# EAGLE schematic ScanseSweepv1.1 (EAGLE 9.4.2)
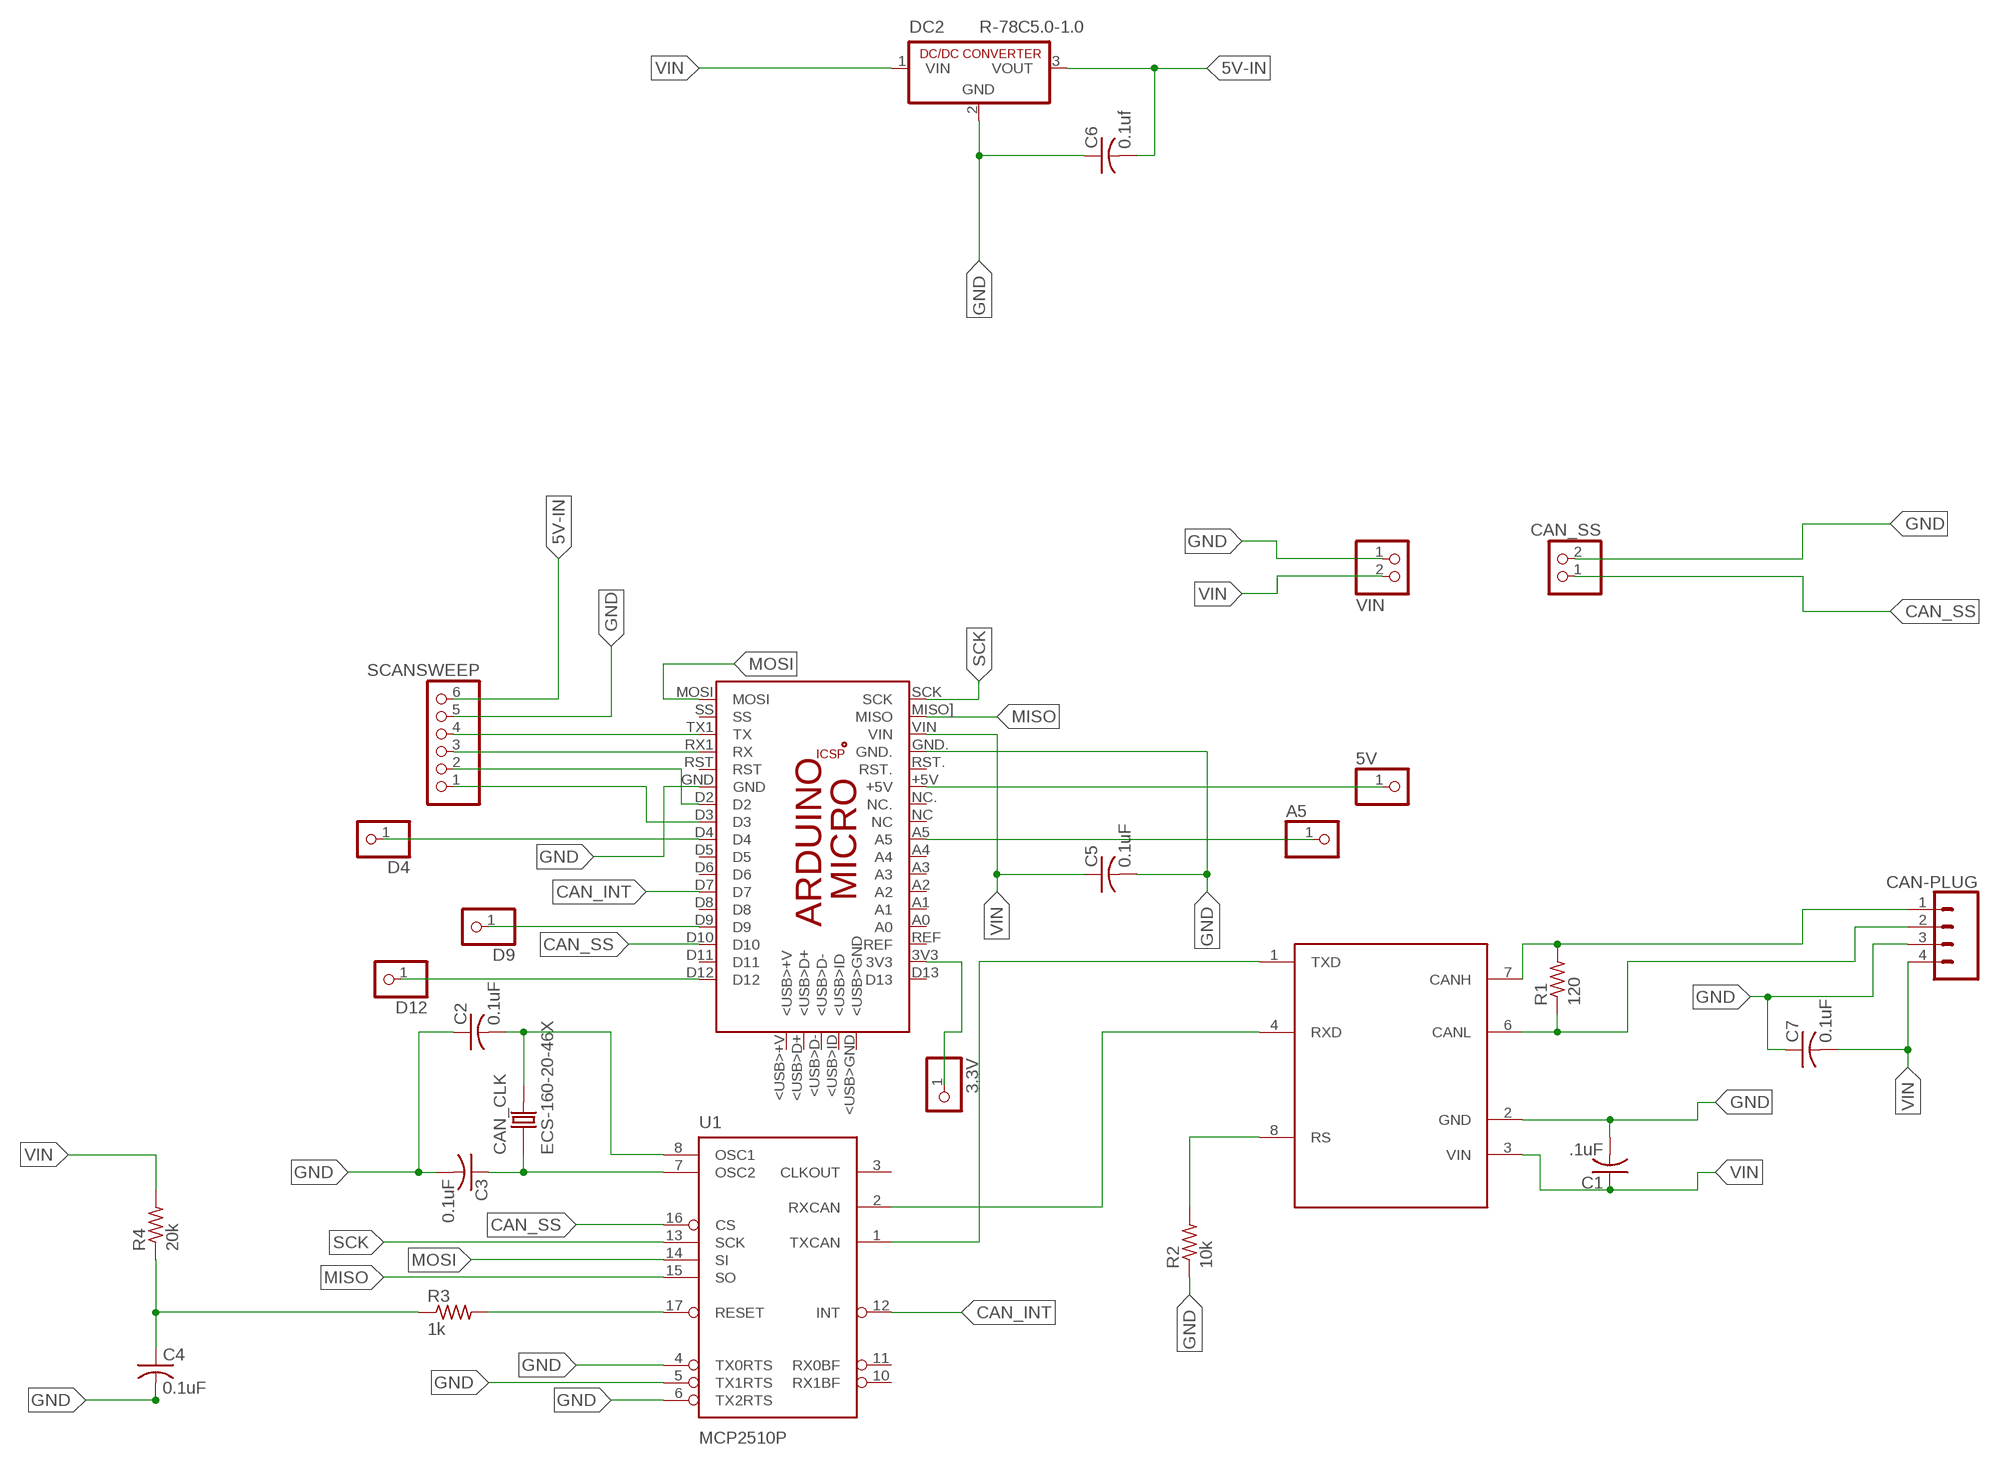
[diagram p0: schematic, sheet 1]

## Parts
3.3V  PINHD-1X1  [1X01]
5V  PINHD-1X1  [1X01]
A5  PINHD-1X1  [1X01]
C1  .1uF  C-US025-024X044  [C025-024X044]
C2  0.1uF  C-US025-024X044  [C025-024X044]
C3  0.1uF  C-US025-024X044  [C025-024X044]
C4  0.1uF  C-US025-024X044  [C025-024X044]
C5  0.1uF  C-US025-024X044  [C025-024X044]
C6  0.1uf  C-US025-024X044  [C025-024X044]
C7  0.1uF  C-US025-024X044  [C025-024X044]
CAN_CLK  ECS-160-20-46X  [XTAL_ECS-160-20-46X]
CAN_SS_TEST  CAN_SS  PINHD-1X2  [1X02]
D4  PINHD-1X1  [1X01]
D9  PINHD-1X1  [1X01]
D12  PINHD-1X1  [1X01]
DC2  R-78C5.0-1.0  [SIP3]
J1  CAN-PLUG  CONN_04SCREW  [SCREWTERMINAL-3.5MM-4]
PCB1  ARDUINO_MICRO  [ARDUINO_MICRO]
R1  120  R-US_0204/5  [0204/5]
R2  10k  R-US_0204/5  [0204/5]
R3  1k  R-US_0204/5  [0204/5]
R4  20k  R-US_0204/5  [0204/5]
SCANSESWEEP  SCANSWEEP  PINHD-1X6  [1X06]
U1  MCP2510P  [DIL18]
U$1  MCP2551MCP2551  [DIL08]
VIN_TEST  VIN  PINHD-1X2  [1X02]

## Nets
3.3V: 3.3V.1 PCB1.3V3
5V: 5V.1 PCB1.+5V
5V-IN: C6.2 DC2.3(VOUT) SCANSESWEEP.6
A5: A5.1 PCB1.A5
CAN_INT: PCB1.D7 U1.12(INT)
CAN_SS: CAN_SS_TEST.1 PCB1.D10 U1.16(CS)
CANH: J1.1 R1.2 U$1.7(CANH)
CANL: J1.2 R1.1 U$1.6(CANL)
D2: PCB1.D2 SCANSESWEEP.2
D3: PCB1.D3 SCANSESWEEP.1
D4: D4.1 PCB1.D4
D9: D9.1 PCB1.D9
D12: D12.1 PCB1.D12
GND: C1.2 C2.1 C3.2 C4.2 C5.2 C6.1 C7.1 CAN_SS_TEST.2 DC2.2(GND) J1.3 PCB1.GND PCB1.GND. R2.1 SCANSESWEEP.5 U1.4(TX0RTS) U1.5(TX1RTS) U1.6(TX2RTS) U$1.2(GND) VIN_TEST.1
MISO: PCB1.MISO](MISO) U1.15(SO)
MOSI: PCB1.MOSI U1.14(SI)
N$13: C4.1 R3.1 R4.1
OSC1: C2.2 CAN_CLK.2 U1.8(OSC1)
OSC2: C3.1 CAN_CLK.1 U1.7(OSC2)
RESET: R3.2 U1.17(RESET)
RS: R2.2 U$1.8(RS)
RX: PCB1.RX1(RX) SCANSESWEEP.3
RXCAN: U1.2(RXCAN) U$1.4(RXD)
SCK: PCB1.SCK U1.13(SCK)
TX: PCB1.TX1(TX) SCANSESWEEP.4
TXCAN: U1.1(TXCAN) U$1.1(TXD)
VIN: C1.1 C5.1 C7.2 DC2.1(VIN) J1.4 PCB1.VIN R4.2 U$1.3(VIN) VIN_TEST.2
Unconnected: PCB1.5V PCB1.<USB>+V PCB1.<USB>D+ PCB1.<USB>D- PCB1.<USB>GND PCB1.<USB>ID PCB1.A0 PCB1.A1 PCB1.A2 PCB1.A3 PCB1.A4 PCB1.D5 PCB1.D6 PCB1.D8 PCB1.D11 PCB1.D13 PCB1.GND_ PCB1.MISO. PCB1.MOSI. PCB1.NC PCB1.NC. PCB1.REF PCB1.RESET.. PCB1.RST PCB1.RST. PCB1.SCK. PCB1.SS U1.3(CLKOUT) U1.9(VSS) U1.10(RX1BF) U1.11(RX0BF) U1.18(VDD)

## Library data of the parts
3.3V 5V A5 D4 D9 D12 = pinhead:PINHD-1X1: PIN HEADER
C1-C7 = rcl:C-US: CAPACITOR, American symbol; SPICEPREFIX: C
CAN_CLK = ECS-160-20-46X:ECS-160-20-46X: QUARTZ CRYSTAL T/H; DESCRIPTION: Crystal 16MHz ±30ppm _Tol_ ±50ppm _Stability_ 20pF FUND 50Ohm; DIGI-KEY_PART_NUMBER: XC1759-ND; DIGI-KEY_PURCHASE_URL: https://www.digikey.com/product-detail/en/ecs-inc/ECS-160-20-46X/XC1759-ND/2676589?utm_source=snapeda&utm_medium=aggregator&utm_campaign=symbol; MF: ECS Inc.; MP: ECS-160-20-46X; PACKAGE: HC46/X ECS International
CAN_SS_TEST VIN_TEST = pinhead:PINHD-1X2: PIN HEADER
DC2 = dc-dc-converter:R-78C*-1.0: INNOLINE DC/DC-Converter 1.0 AMP SIP3 Single Output Source: Data sheet <http://www.mikrocontroller.net/attachment/150645/157764-da-01-en-DC_DC_WANDLER_R_78C5_0_1_0.pdf>
J1 = SparkFun-Connectors:CONN_04: Multi connection point. Often used as Generic Header-pin footprint for 0.1 inch spaced/style header connections On any of the 0.1 inch spaced packages, you can populate with these: Break Away Headers - Straight <https://www.sparkfun.com/products/116> (PRT-00116) Break Away Male Headers - Right Angle <https://www.sparkfun.com/products/553> (PRT-00553) Female Headers <https://www.sparkfun.com/products/115> (PRT-00115) Break Away Headers - Machine Pin <https://www.sparkfun.com/products/117> (PRT-00117) Break Away Female Headers - Swiss Machine Pin <https://www.sparkfun.com/products/743> (PRT-00743) For SCREWTERMINALS and SPRING TERMINALS visit here: Screw Terimnals on SparkFun.com <https://www.sparkfun.com/search/results?term=Screw+Terminals> (5mm/3.5mm/2.54mm spacing) This device is also useful as a general connection point to wire up your design to another part of your project. Our various solder wires solder well into these plated through hole pads. Hook-Up Wire - Assortment (Stranded, 22 AWG) <https://www.sparkfun.com/products/11375> (PRT-11375) Hook-Up Wire - Assortment (Solid Core, 22 AWG) <https://www.sparkfun.com/products/11367> (PRT-11367) View the entire wire category on our website here <https://www.sparkfun.com/categories/141> Special notes: Molex polarized connector foot print use with SKU : PRT-08231 with associated crimp pins and housings. 1MM SMD Version SKU: PRT-10208; PROD_ID: CONN-14485
PCB1 = E14_Arduino_revC:ARDUINO_MICRO: Device for representing an Arduino Micro board with a footprint in an EAGLE design. Created by Dave Young for Element14. More EAGLE documentation at: http://www.element14.com/community/community/knode/cadsoft_eagle
R1-R4 = rcl:R-US_: RESISTOR, American symbol; SPICEPREFIX: R
SCANSESWEEP = pinhead:PINHD-1X6: PIN HEADER
U1 = microchip_can:MCP2510
U$1 = MCP2551:MCP2551